# Altium schematic sheet TDA-sma_rev2.SchDoc
size A4
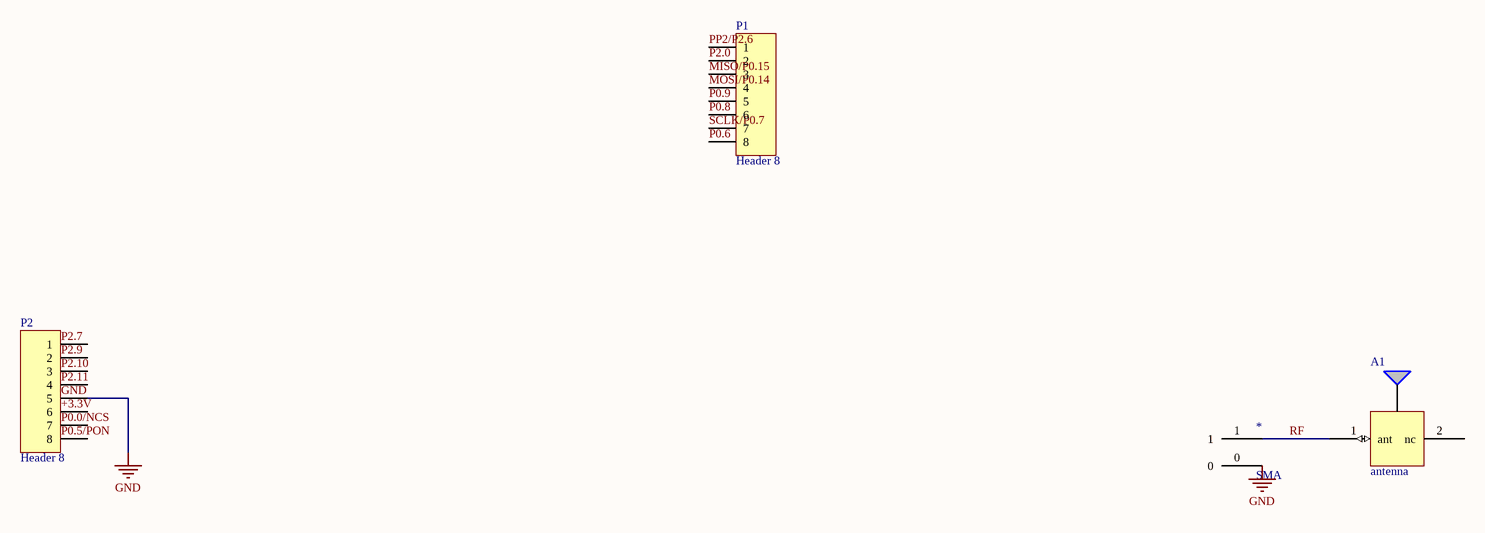
[diagram p0: TDA-sma_rev2.SchDoc]

## Parts
*  SMA  [SMA]
A1  antenna  [Chip Antenna]
P1  Header 8  [HDR1X8]
P2  Header 8  [HDR1X8]

## Nets
GND: *.0 P2.5
MISO/P0.15: P1.3
MOSI/P0.14: P1.4
P0.6: P1.8
P0.8: P1.6
P0.9: P1.5
P2.0: P1.2
PP2/P2.6: P1.1
RF: *.1 A1.1(ant)
SCLK/P0.7: P1.7

Not connected (* = marked no-connect by the designer): A1 2(nc); P2 1 2 3 4 6 7 8

## Notes on the sheet
- Labels drawn without touching a wire or pin: +3.3V, GND, P0.0/NCS, P0.5/PON, P2.7, P2.9, P2.10, P2.11

## Library data of the parts
P1 P2 = Header 8: Header, 8-Pin; LatestRevisionDate: 17-Jul-2002; LatestRevisionNote: Re-released for DXP Platform.; Publisher: Altium Limited